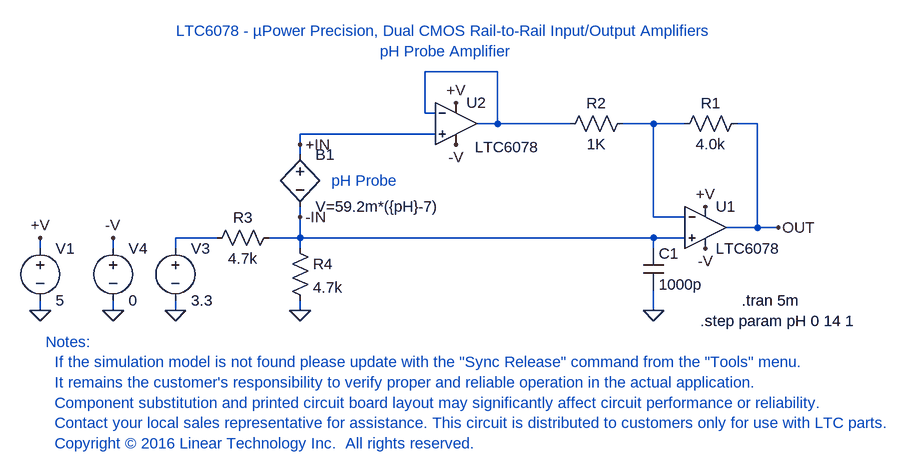
[diagram p0: schematic LTC6078_TA10.asc]
LTC6078_TA10.asc, the LTspice schematic file:
Version 4
SHEET 1 1080 748
WIRE 16 -80 -96 -80
WIRE -96 -16 -96 -80
WIRE -80 -16 -96 -16
WIRE 16 0 16 -80
WIRE 16 0 -16 0
WIRE 128 0 16 0
WIRE 256 0 208 0
WIRE 304 0 256 0
WIRE 416 0 384 0
WIRE -80 16 -288 16
WIRE -288 32 -288 16
WIRE -288 48 -288 32
WIRE -288 144 -288 128
WIRE 256 144 256 0
WIRE 304 144 256 144
WIRE 416 160 416 0
WIRE 416 160 368 160
WIRE 448 160 416 160
WIRE -416 176 -480 176
WIRE -288 176 -288 144
WIRE -288 176 -336 176
WIRE 256 176 -288 176
WIRE 304 176 256 176
WIRE -688 192 -688 176
WIRE -576 192 -576 176
WIRE -480 192 -480 176
WIRE -288 192 -288 176
WIRE 256 192 256 176
WIRE -688 288 -688 272
WIRE -576 288 -576 272
WIRE -480 288 -480 272
WIRE -288 288 -288 272
WIRE 256 288 256 256
FLAG 448 160 OUT
FLAG -288 288 0
FLAG 256 288 0
FLAG -480 288 0
FLAG -688 176 +V
FLAG -576 288 0
FLAG -576 176 -V
FLAG -288 32 +IN
FLAG -288 144 -IN
FLAG -48 -32 +V
FLAG 336 128 +V
FLAG -48 32 -V
FLAG 336 192 -V
FLAG -688 288 0
SYMBOL LTC6078 336 160 R0
SYMATTR InstName U1
SYMBOL LTC6078 -48 0 R0
WINDOW 3 29 36 Left 2
SYMATTR InstName U2
SYMBOL res 400 -16 R90
WINDOW 0 0 56 VBottom 2
WINDOW 3 32 56 VTop 2
SYMATTR InstName R1
SYMATTR Value 4.0k
SYMBOL res 224 -16 R90
WINDOW 0 0 56 VBottom 2
WINDOW 3 32 56 VTop 2
SYMATTR InstName R2
SYMATTR Value 1K
SYMBOL res -432 192 R270
WINDOW 0 32 56 VTop 2
WINDOW 3 0 56 VBottom 2
SYMATTR InstName R3
SYMATTR Value 4.7k
SYMBOL cap 240 192 R0
SYMATTR InstName C1
SYMATTR Value 1000p
SYMBOL voltage -480 176 R0
WINDOW 123 0 0 Left 2
WINDOW 39 0 0 Left 2
SYMATTR InstName V3
SYMATTR Value 3.3
SYMBOL voltage -576 176 R0
WINDOW 123 0 0 Left 2
WINDOW 39 0 0 Left 2
SYMATTR InstName V4
SYMATTR Value 0
SYMBOL bv -288 32 R0
SYMATTR InstName B1
SYMATTR Value V=59.2m*({pH}-7)
SYMBOL res -304 176 R0
SYMATTR InstName R4
SYMATTR Value 4.7k
SYMBOL voltage -688 176 R0
WINDOW 123 0 0 Left 2
WINDOW 39 0 0 Left 2
SYMATTR InstName V1
SYMATTR Value 5
TEXT -64 -96 Bottom 2 ;LTC6078 - µPower Precision, Dual CMOS Rail-to-Rail Input/Output Amplifiers\npH Probe Amplifier
TEXT -680 336 Left 2 ;Notes:\n  If the simulation model is not found please update with the "Sync Release" command from the "Tools" menu.\n  It remains the customer's responsibility to verify proper and reliable operation in the actual application.\n  Component substitution and printed circuit board layout may significantly affect circuit performance or reliability.\n  Contact your local sales representative for assistance. This circuit is distributed to customers only for use with LTC parts.\n  Copyright © 2016 Linear Technology Inc.  All rights reserved.
TEXT -240 88 Left 2 ;pH Probe
TEXT 328 304 Left 2 !.step param pH 0 14 1
TEXT 392 272 Left 2 !.tran 5m

The netlist it stands for:
* LTC6078_TA10.asc
XU1 -IN N002 +V -V OUT LTC6078  ; pins IN+ IN- VCC VEE OUT
XU2 +IN N001 +V -V N001 LTC6078  ; pins IN+ IN- VCC VEE OUT
R1 OUT N002 4.0k
R2 N002 N001 1K
R3 N003 -IN 4.7k
C1 -IN 0 1000p
V3 N003 0 3.3
V4 -V 0 0
B1 +IN -IN V=59.2m*({pH}-7)
R4 -IN 0 4.7k
V1 +V 0 5
* LTC6078 - µPower Precision, Dual CMOS Rail-to-Rail Input/Output Amplifiers
* pH Probe Amplifier
* Notes:
*   If the simulation model is not found please update with the "Sync Release" command from the "Tools" menu.
*   It remains the customer's responsibility to verify proper and reliable operation in the actual application.
*   Component substitution and printed circuit board layout may significantly affect circuit performance or reliability.
*   Contact your local sales representative for assistance. This circuit is distributed to customers only for use with LTC parts.
*   Copyright © 2016 Linear Technology Inc.  All rights reserved.
* pH Probe
.step param pH 0 14 1
.tran 5m
.lib LTC5.lib
.backanno
.end